# Altium schematic sheet TDA1308.SchDoc
size A4
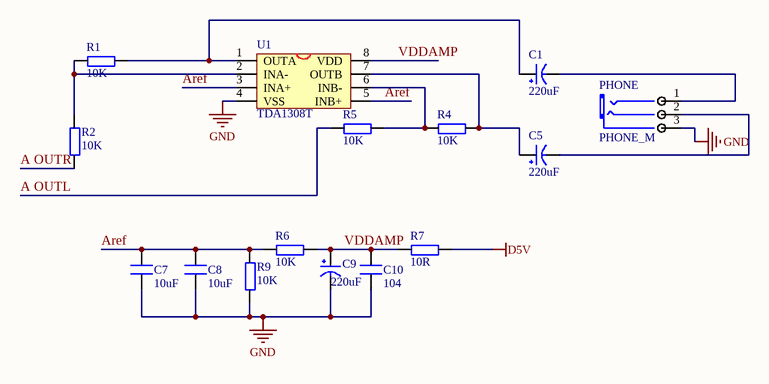
[diagram p0: TDA1308.SchDoc]

## Parts
C1  220uF  [CC6.56.5]
C5  220uF  [CC6.56.5]
C7  10uF  [0603P]
C8  10uF  [0603P]
C9  220uF  [CC6.56.5]
C10  104  [0603P]
PHONE  PHONE_M  [PHONE_ST]
R1  10K  [0603P]
R2  10K  [0603P]
R4  10K  [0603P]
R5  10K  [0603P]
R6  10K  [0603P]
R7  10R  [0603P]
R9  10K  [0603P]
U1  TDA1308T  [SOP-8]

## Nets
D5V: R7.2
GND: C7.1 C8.1 C9.2(GND) C10.1 PHONE.3(COM) R9.1 U1.4(VSS)
A OUTL: R5.1
A OUTR: R2.1
Aref: C7.2 C8.2 R6.1 R9.2 U1.3(INA+) U1.5(INB+)
VDDAMP: C9.1(VCC) C10.2 R6.2 R7.1 U1.8(VDD)
NetC1_1: C1.1(VCC) R1.2 U1.1(OUTA)
NetC1_2: C1.2(GND) PHONE.1(CHL)
NetC5_1: C5.1(VCC) R4.2 U1.7(OUTB)
NetC5_2: C5.2(GND) PHONE.2(CHR)
NetR1_1: R1.1 R2.2 U1.2(INA-)
NetR4_1: R4.1 R5.2 U1.6(INB-)

## Library data of the parts
C1 C5 C9 = CAP
C7 C8 C10 = C
R1 R2 R4-R7 R9 = R
U1 = TDA1308